# EAGLE schematic bit-shifter (EAGLE 6.3)
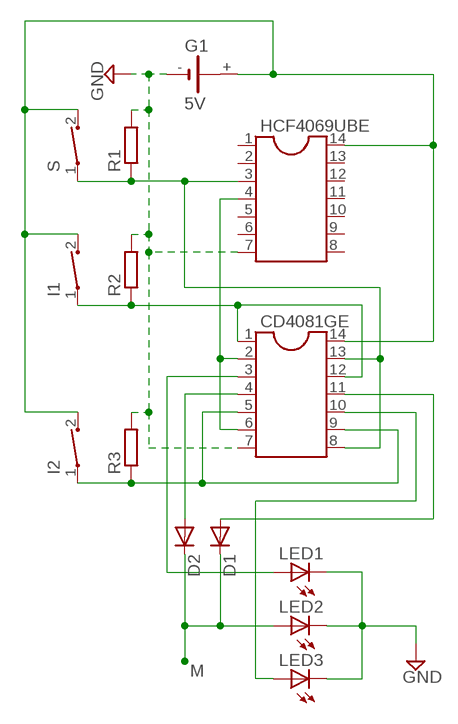
[diagram p0: schematic, sheet 1]

## Parts
CD4081GE  DIL14  [DIL14]
D1  1N4446  [DO35-10]
D2  1N4446  [DO35-10]
G1  5V  1V60R  [1V60R]
HCF4069UBE  DIL14  [DIL14]
I1  CT10-XXXX-A2  [CT10-XXXX-A2]
I2  CT10-XXXX-A2  [CT10-XXXX-A2]
LED1  LAP4-BOTTOM  [P47F-BOTTOM]
LED2  LAP4-BOTTOM  [P47F-BOTTOM]
LED3  LAP4-BOTTOM  [P47F-BOTTOM]
R1  R-EU_0204/2V  [0204V]
R2  R-EU_0204/2V  [0204V]
R3  R-EU_0204/2V  [0204V]
S  CT10-XXXX-A2  [CT10-XXXX-A2]

## Nets
CD4081: CD4081GE.1 CD4081GE.12 I1.1 R2.1
GND: CD4081GE.7 G1.- HCF4069UBE.7 LED1.C LED2.C LED3.C R1.2 R2.2 R3.2
N$1: CD4081GE.14 G1.+ HCF4069UBE.14 I1.2 I2.2 S.2
N$2: D1.C D2.C LED2.A
N$4: CD4081GE.5 CD4081GE.9 I2.1 R3.1
N$5: CD4081GE.10 LED3.A
N$6: CD4081GE.11 D1.A
N$8: CD4081GE.2 CD4081GE.6 HCF4069UBE.4
N$9: CD4081GE.3 LED1.A
N$11: CD4081GE.4 D2.A
R5: CD4081GE.8 CD4081GE.13 HCF4069UBE.3 R1.1 S.1
Unconnected: G1.+@1(+) HCF4069UBE.1 HCF4069UBE.2 HCF4069UBE.5 HCF4069UBE.6 HCF4069UBE.8 HCF4069UBE.9 HCF4069UBE.10 HCF4069UBE.11 HCF4069UBE.12 HCF4069UBE.13

## Notes on the sheet
- M

## Library data of the parts
CD4081GE HCF4069UBE = ic-package:DIL14: Dual In Line / Socket
D1 D2 = diode:1N4446: DIODE high speed (Philips)
G1 = battery:1V60R: NC ACCU Varta
I1 I2 S = switch-coto:CT10-XXXX-: CT10 Series Molded Switch Source: www.cotorelay.com .. Coto_Technology__CT10-1530-G1.pdf
LED1-LED3 = led:*P4: PointLED® Enhanced Thinfilm LED TOP & BOTTOM mount LS P47F, LR P47F, LA P47F, LY P47F, LT P4SG, LB P4SG, LW P4SG Source: http://catalog.osram-os.com .. LA_LR_LS_LY_P47F_Pb_free.pdf
R1-R3 = resistor:R-EU_: RESISTOR, European symbol